# EAGLE design demeter_v26 (EAGLE 6.2)
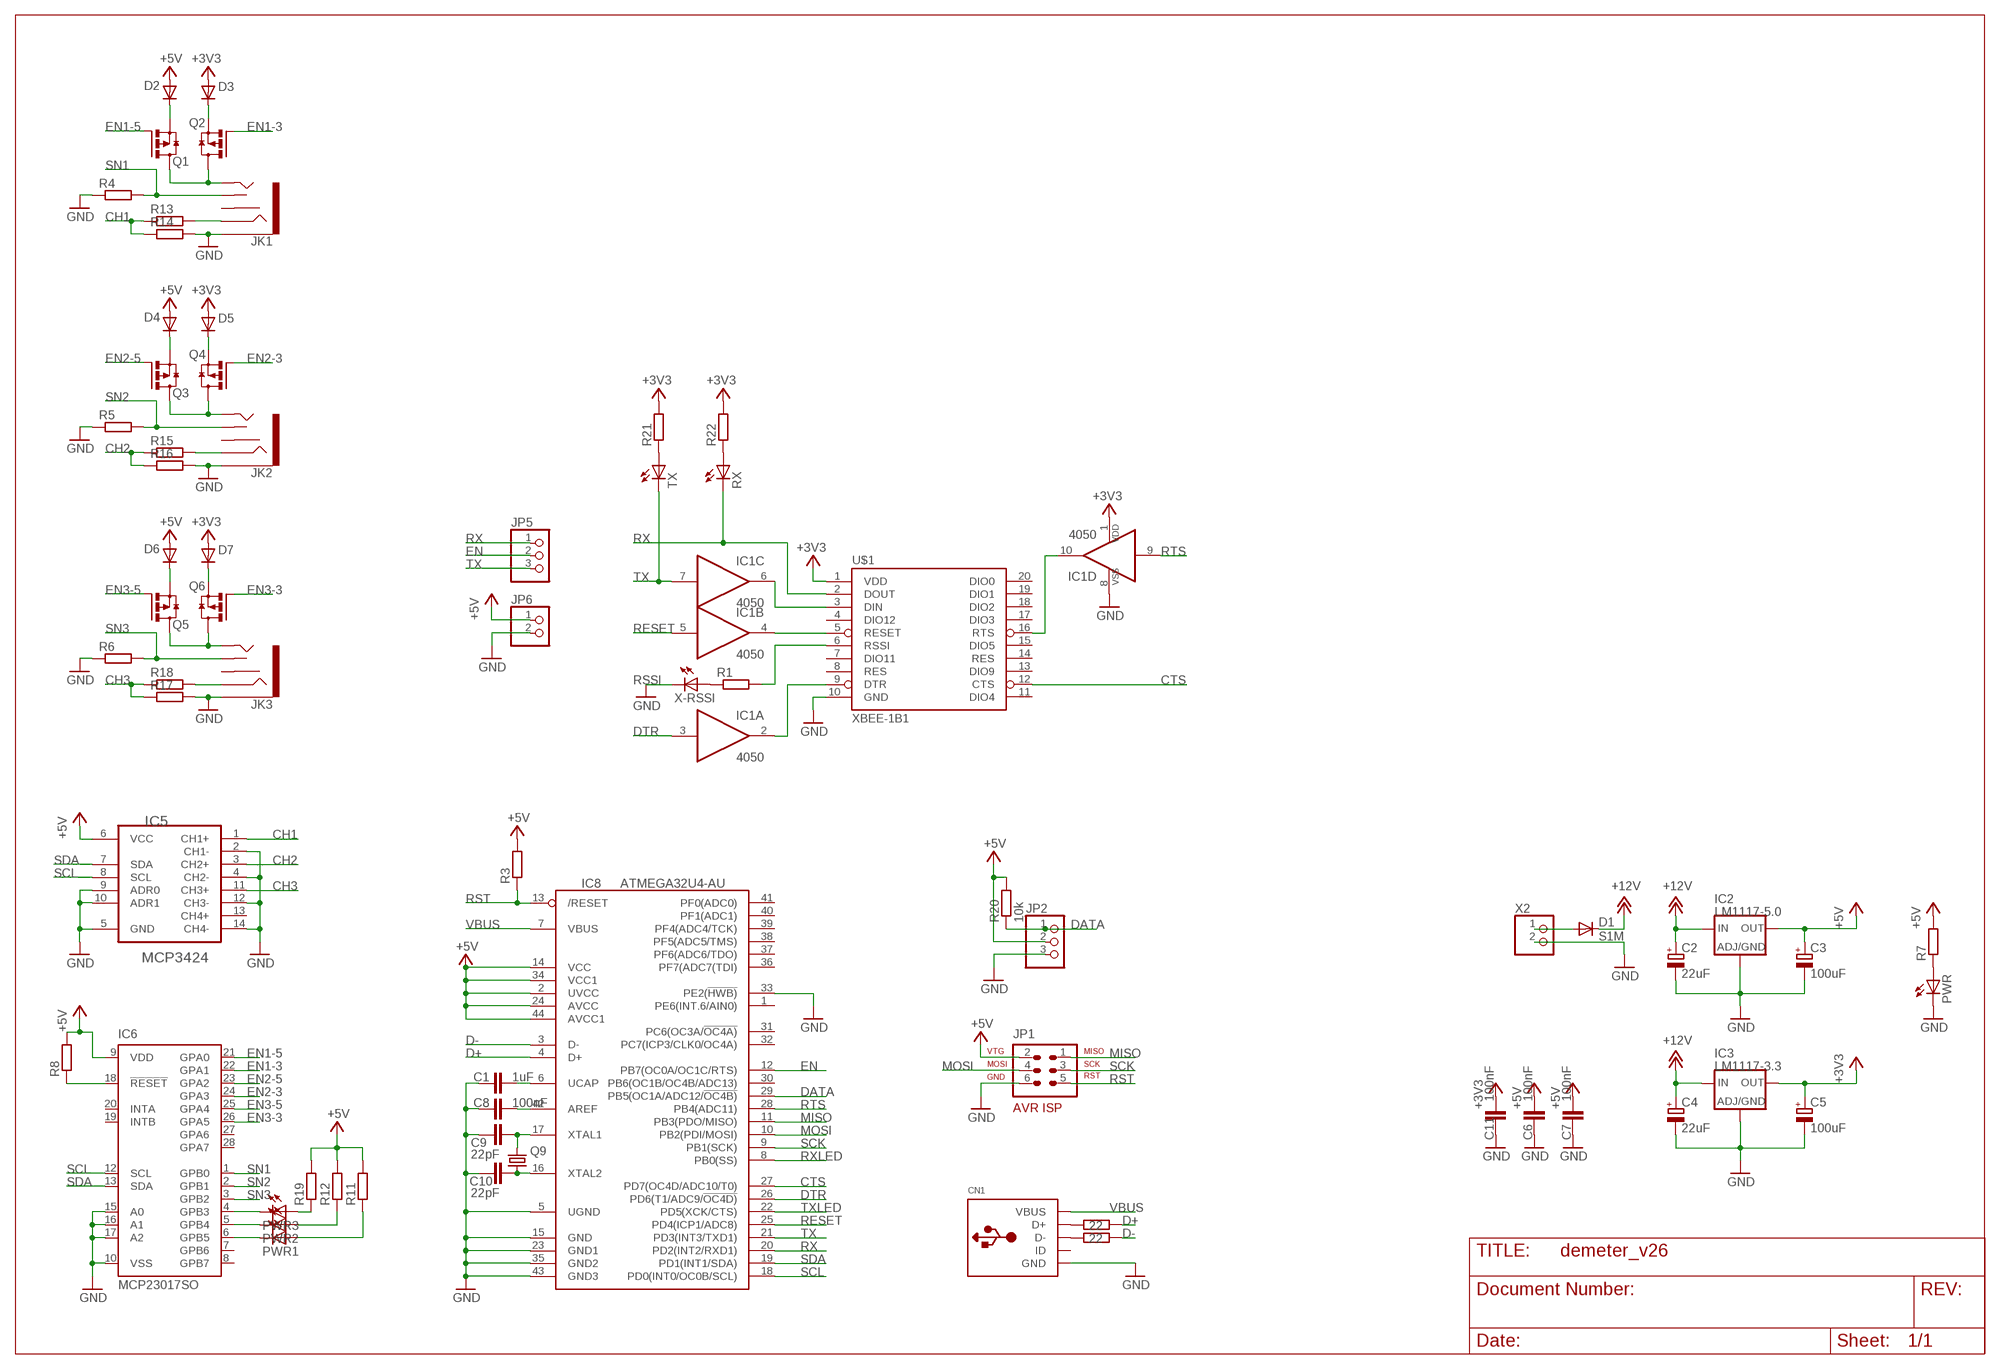
[diagram p0: schematic, sheet 1]

## Parts
C1  1uF  C-EUC0805K  [C0805K]
C2  22uF  CPOL-EUPD  [PANASONIC_D]
C3  100uF  CPOL-EUPD  [PANASONIC_D]
C4  22uF  CPOL-EUPD  [PANASONIC_D]
C5  100uF  CPOL-EUPD  [PANASONIC_D]
C6  100nF  C-EUC0805K  [C0805K]
C7  100nF  C-EUC0805K  [C0805K]
C8  100nF  C-EUC0805K  [C0805K]
C9  22pF  C-EUC0805K  [C0805K]
C10  22pF  C-EUC0805K  [C0805K]
C11  100nF  C-EUC0805K  [C0805K]
CN1  USBMINIB  [USB-MINIB]
D1  S1M  [DO-214AC]
D2  MBR0520  [SOD123]
D3  MBR0520  [SOD123]
D4  MBR0520  [SOD123]
D5  MBR0520  [SOD123]
D6  MBR0520  [SOD123]
D7  MBR0520  [SOD123]
IC1  4050  4050D  [SO16]
IC2  LM1117-5.0  LM1117DT  [DPACK]
IC3  LM1117-3.3  LM1117DT  [DPACK]
IC5  MCP3424  [SO14]
IC6  MCP23017SO  [SO28W]
IC8  ATMEGA32U4-AU  [TQFP44]
JK1  AUDIO-JACK2PTH  [AUDIO-JACK]
JK2  AUDIO-JACK2PTH  [AUDIO-JACK]
JK3  AUDIO-JACK2PTH  [AUDIO-JACK]
JP1  AVR-ISP-6  [AVR-ISP-6]
JP2  PINHD-1X3180  [1X03]
JP5  PINHD-1X3180  [1X03]
JP6  PINHD-1X2  [1X02]
PWR  LED0805  [CHIP-LED0805]
PWR1  LED0805  [CHIP-LED0805]
PWR2  LED0805  [CHIP-LED0805]
PWR3  LED0805  [CHIP-LED0805]
Q1  IRLML6402  [SOT23]
Q2  IRLML6402  [SOT23]
Q3  IRLML6402  [SOT23]
Q4  IRLML6402  [SOT23]
Q5  IRLML6402  [SOT23]
Q6  IRLML6402  [SOT23]
Q9  CRYSTALHC49UP  [HC49UP]
R1  R-EU_R0805  [R0805]
R3  R-EU_R0805  [R0805]
R4  R-EU_R0805  [R0805]
R5  R-EU_R0805  [R0805]
R6  R-EU_R0805  [R0805]
R7  R-EU_R0805  [R0805]
R8  R-EU_R0805  [R0805]
R9  22  R-EU_R0805  [R0805]
R10  22  R-EU_R0805  [R0805]
R11  R-EU_R0805  [R0805]
R12  R-EU_R0805  [R0805]
R13  R-EU_R0805  [R0805]
R14  R-EU_R0805  [R0805]
R15  R-EU_R0805  [R0805]
R16  R-EU_R0805  [R0805]
R17  R-EU_R0805  [R0805]
R18  R-EU_R0805  [R0805]
R19  R-EU_R0805  [R0805]
R20  10k  R-EU_R0805  [R0805]
R21  R-EU_R0805  [R0805]
R22  R-EU_R0805  [R0805]
RX  LED0805  [CHIP-LED0805]
TX  LED0805  [CHIP-LED0805]
U$1  XBEE-1B1  [XBEE-1]
X2  W237-102  [W237-102]
X-RSSI  LED0805  [CHIP-LED0805]

## Nets
+3V3: C5.+ C11.1 D3.A D5.A D7.A IC1.1(P:VDD) IC3.4(OUT) R21.2 R22.2 U$1.1(VDD)
+5V: C3.+ C6.1 C7.1 D2.A D4.A D6.A IC2.4(OUT) IC5.6(VCC) IC6.9(VDD) IC8.2(UVCC) IC8.14(VCC) IC8.24(AVCC) IC8.34(VCC1) IC8.44(AVCC1) JP1.2(VTG) JP2.2 JP6.1 R3.2 R7.2 R8.2 R11.2 R12.2 R19.2 R20.2
+12V: C2.+ C4.+ D1.C IC2.3(IN) IC3.3(IN)
CH1: IC5.1(CH1+) R13.1 R14.1
CH2: IC5.3(CH2+) R15.1 R16.1
CH3: IC5.11(CH3+) R17.1 R18.1
CTS: IC8.27(PD7(OC4D/ADC10/T0)) U$1.12(CTS)
D+: IC8.4(D+) R9.1
D-: IC8.3(D-) R10.1
DATA: IC8.29(PB5(OC1A/ADC12/!OC4B)) JP2.1 R20.1
DTR: IC1.3(A:I) IC8.26(PD6(T1/ADC9/!OC4D))
EN: IC8.12(PB7(OC0A/OC1C/RTS)) JP5.2
EN1-3: IC6.22(GPA1) Q2.1(G)
EN1-5: IC6.21(GPA0) Q1.1(G)
EN2-3: IC6.24(GPA3) Q4.1(G)
EN2-5: IC6.23(GPA2) Q3.1(G)
EN3-3: IC6.26(GPA5) Q6.1(G)
EN3-5: IC6.25(GPA4) Q5.1(G)
GND: C1.2 C2.- C3.- C4.- C5.- C6.2 C7.2 C8.2 C9.2 C10.2 C11.2 CN1.GND IC1.8(P:VSS) IC2.1(ADJ) IC3.1(ADJ) IC5.2(CH1-) IC5.4(CH2-) IC5.5(GND) IC5.9(ADR0) IC5.10(ADR1) IC5.12(CH3-) IC5.14(CH4-) IC6.10(VSS) IC6.15(A0) IC6.16(A1) IC6.17(A2) IC8.5(UGND) IC8.15(GND) IC8.23(GND1) IC8.33(PE2(!HWB)) IC8.35(GND2) IC8.43(GND3) JK1.SLEEVE JK2.SLEEVE JK3.SLEEVE JP1.6(GND) JP2.3 JP6.2 PWR.C R4.1 R5.1 R6.1 R14.2 R16.2 R17.2 U$1.10(GND) X2.2 X-RSSI.C
MISO: IC8.11(PB3(PDO/MISO)) JP1.1(MISO)
MOSI: IC8.10(PB2(PDI/MOSI)) JP1.4(MOSI)
N$1: D1.A X2.1
N$2: PWR.A R7.1
N$3: IC1.6(C:O) U$1.3(DIN)
N$4: IC1.4(B:O) U$1.5(RESET)
N$5: PWR1.A R11.1
N$6: R1.1 X-RSSI.A
N$7: IC1.2(A:O) U$1.9(DTR)
N$8: IC1.10(D:O) U$1.16(RTS)
N$9: IC6.6(GPB5) PWR1.C
N$10: IC6.4(GPB3) PWR3.C
N$11: IC6.18(!RESET) R8.1
N$12: JK1.TIP Q1.3(D) Q2.3(D)
N$13: D2.C Q1.2(S)
N$14: D3.C Q2.2(S)
N$15: JK2.TIP Q3.3(D) Q4.3(D)
N$16: D4.C Q3.2(S)
N$17: D5.C Q4.2(S)
N$18: JK3.TIP Q5.3(D) Q6.3(D)
N$19: D6.C Q5.2(S)
N$20: D7.C Q6.2(S)
N$22: PWR2.A R12.1
N$23: PWR3.A R19.1
N$24: C1.1 IC8.6(UCAP)
N$25: C8.1 IC8.42(AREF)
N$26: C9.1 IC8.17(XTAL1) Q9.2
N$27: C10.1 IC8.16(XTAL2) Q9.1
N$28: CN1.D+ R9.2
N$29: CN1.D- R10.2
N$30: JK1.RING R13.2
N$32: JK2.RING R15.2
N$33: IC6.5(GPB4) PWR2.C
N$34: JK3.RING R18.2
N$36: R21.1 TX.A
N$37: R22.1 RX.A
RESET: IC1.5(B:I) IC8.25(PD4(ICP1/ADC8))
RSSI: R1.2 U$1.6(RSSI)
RST: IC8.13(/RESET) JP1.5(RST) R3.1
RTS: IC1.9(D:I) IC8.28(PB4(ADC11))
RX: IC8.20(PD2(INT2/RXD1)) JP5.1 RX.C U$1.2(DOUT)
RXLED: IC8.8(PB0(SS))
SCK: IC8.9(PB1(SCK)) JP1.3(SCK)
SCL: IC5.8(SCL) IC6.12(SCL) IC8.18(PD0(INT0/OC0B/SCL))
SDA: IC5.7(SDA) IC6.13(SDA) IC8.19(PD1(INT1/SDA))
SN1: IC6.1(GPB0) JK1.TSH R4.2
SN2: IC6.2(GPB1) JK2.TSH R5.2
SN3: IC6.3(GPB2) JK3.TSH R6.2
TX: IC1.7(C:I) IC8.21(PD3(INT3/TXD1)) JP5.3 TX.C
TXLED: IC8.22(PD5(XCK/CTS))
VBUS: CN1.VBUS IC8.7(VBUS)
Unconnected: CN1.ID IC1.11(E:I) IC1.12(E:O) IC1.14(F:I) IC1.15(F:O) IC5.13(CH4+) IC6.7(GPB6) IC6.8(GPB7) IC6.19(INTB) IC6.20(INTA) IC6.27(GPA6) IC6.28(GPA7) IC8.1(PE6(INT.6/AIN0)) IC8.30(PB6(OC1B/OC4B/ADC13)) IC8.31(PC6(OC3A/!OC4A)) IC8.32(PC7(ICP3/CLK0/OC4A)) IC8.36(PF7(ADC7(TDI)) IC8.37(PF6(ADC6/TDO)) IC8.38(PF5(ADC5/TMS)) IC8.39(PF4(ADC4/TCK)) IC8.40(PF1(ADC1)) IC8.41(PF0(ADC0)) JK1.RSH JK2.RSH JK3.RSH U$1.4(DIO12) U$1.7(DIO11) U$1.8(RES) U$1.11(DIO4) U$1.13(DIO9) U$1.14(RES) U$1.15(DIO5) U$1.17(DIO3) U$1.18(DIO2) U$1.19(DIO1) U$1.20(DIO0)

## Library data of the parts
C1 C6-C11 = mark_2:C-EU: CAPACITOR, European symbol
C2-C5 = mark_2:CPOL-EU: POLARIZED CAPACITOR, European symbol
CN1 = mark_2:USB: USB Connectors USBMINIB - Surface Mount Female Mini-B USB Connector 4UConnector: 06564 By microbuilder.eu Thru-hole RA Female Mini-B USB Connector 4UConnector: 18732 By ladyada.net
D1 = mark_2:S1M
D2-D7 = mark_2:MBR0520: SCHOTTKY BARRIER RECTIFIER Source: http://onsemi.com .. MBR0520LT1-D.pdf
IC1 = mark_2:4050: Hex non-inverting BUFFER
IC2 IC3 = mark_2:LM1117: Low drop fixed and adjustable positive voltage regulators 1 A Source: http://www.st.com/stonline/products/literature/ds/7194/ld1117axx.pdf
IC5 = mark_2:MCP3424: Analog-to-Digital Converter; MPN: MCP3424-E/SL; OC_FARNELL: 1630424; OC_NEWARK: 54M4871; PACKAGE: SOIC-14; SUPPLIER: Microchip
IC6 = mark_2:MCP23017: http://ww1.microchip.com/downloads/en/DeviceDoc/21952a.pdf Source: http://ww1.microchip.com/downloads/en/DeviceDoc/21952a.pdf; MF: MICROCHIP; MPN: MCP23017-E/SO; OC_FARNELL: 1332087; OC_NEWARK: 31K2958
IC8 = mark_2:ATMEGA32U4: http://www.ladyada.net/library/eagle
JK1-JK3 = mark_2:AUDIO-JACK2
JP1 = mark_2:AVR-ISP-6: AVR ISP-6 Serial Programming Header
JP2 JP5 = mark_2:PINHD-1X3: PIN HEADER
JP6 = mark_2:PINHD-1X2: PIN HEADER
PWR PWR1-PWR3 RX TX X-RSSI = mark_2:LED
Q1-Q6 = mark_2:IRLML6402: Single P-Channe MOSFET
Q9 = mark_2:CRYSTAL: CRYSTAL
R1 R3-R22 = mark_2:R-EU_: RESISTOR, European symbol
U$1 = mark_2:XBEE-1
X2 = mark_2:W237-102: WAGO SCREW CLAMP

## Board
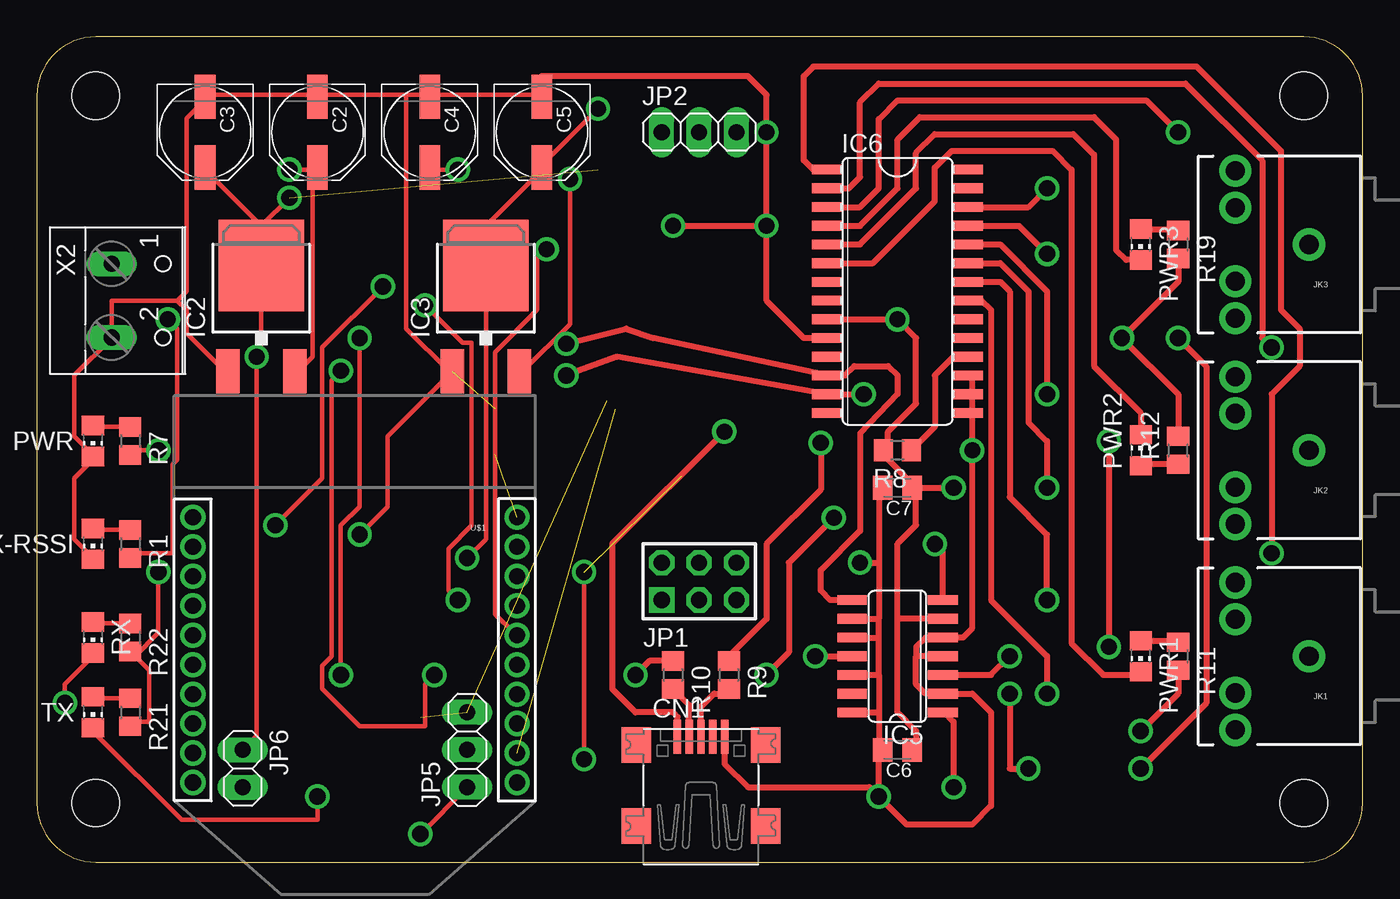
[diagram p1: board, top side]
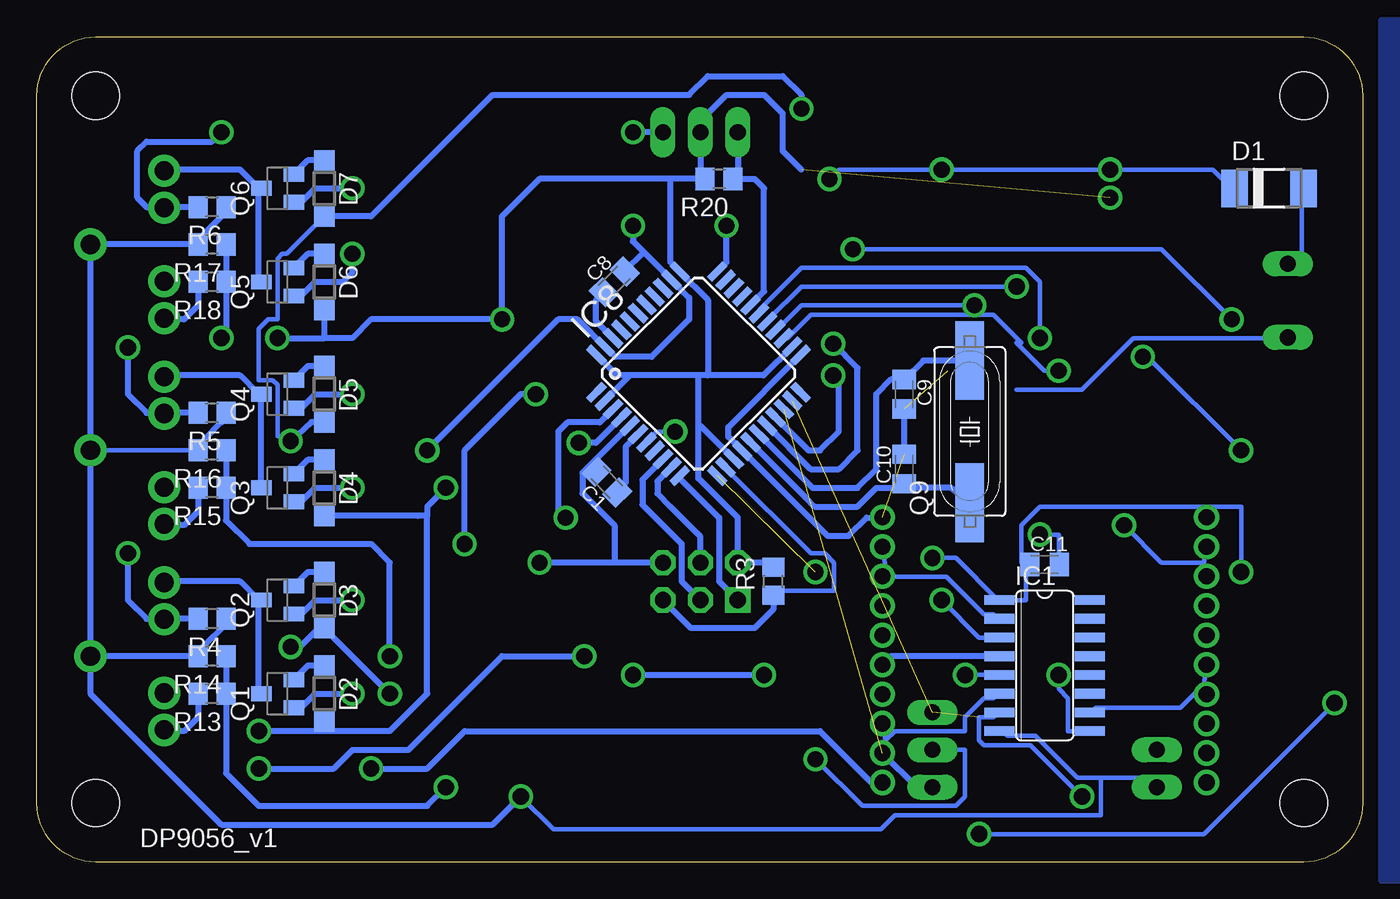
[diagram p2: board, bottom side, seen from below]

Size 90 x 56 mm. Coordinates in mm from the lower left corner, seen from the top.
Copper layers (1*16): Top 0.035mm / dielectric 1.5mm / Bottom 0.035mm
Design rules: minimum track width 12mil, minimum drill 1.1mm, track to track 8mil, track to pad 8mil, pad to pad 8mil, via to via 8mil, smd to smd 8mil, copper to edge 10mil, drill to drill 8mil, minimum pad ring 12mil, minimum via ring 10mil, stop-mask expansion 4mil, vias tented up to drill 25mil, thermal gap 10mil

### Footprints (pad centres in the part's own frame; a part is rotated, then mirrored left to right if it is on the bottom)
C0805K = smd 1.3 x 1.6: 1 -1,0; 2 1,0
PANASONIC_D = smd 3 x 1.4: + 2.4,0; - -2.4,0
USB-MINIB = smd 0.5 x 2.308: D+ 0,4.064; D- -0.8,4.064; GND 1.6,4.064; ID 0.8,4.064; VBUS -1.6,4.064 | smd 2 x 2.4: GND1 -4.4,-2; GND2 -4.4,3.5; GND3 4.4,3.5; GND4 4.4,-2
DO-214AC = smd 1.778 x 2.54: A 2.342,0; C -2.342,0
SOD123 = smd 1.4 x 1.4: A 1.9,0; C -1.9,0
SO16 = smd 0.66 x 2.032: 1 -4.445,-3.073; 2 -3.175,-3.073; 3 -1.905,-3.073; 4 -0.635,-3.073; 5 0.635,-3.073; 6 1.905,-3.073; 7 3.175,-3.073; 8 4.445,-3.073; 9 4.445,3.073; 10 3.175,3.073; 11 1.905,3.073; 12 0.635,3.073; 13 -0.635,3.073; 14 -1.905,3.073; 15 -3.175,3.073; 16 -4.445,3.073
DPACK = smd 1.6 x 3: 1 -2.28,-4.8; 3 2.28,-4.8 | smd 5.8 x 6.2: 4 0,2.38
SO14 = smd 2.032 x 0.66: 1 -3.073,3.81; 2 -3.073,2.54; 3 -3.073,1.27; 4 -3.073,0; 5 -3.073,-1.27; 6 -3.073,-2.54; 7 -3.073,-3.81; 8 3.073,-3.81; 9 3.073,-2.54; 10 3.073,-1.27; 11 3.073,0; 12 3.073,1.27; 13 3.073,2.54; 14 3.073,3.81
SO28W = smd 0.66 x 2.032: 1 -7.62,-4.78; 2 -6.35,-4.78; 3 -5.08,-4.78; 4 -3.81,-4.78; 5 -2.54,-4.78; 6 -1.27,-4.78; 7 0,-4.78; 8 1.27,-4.78; 9 2.54,-4.78; 10 3.81,-4.78; 11 5.08,-4.78; 12 6.35,-4.78; 13 7.62,-4.78; 14 8.89,-4.78; 15 8.89,4.78; 16 7.62,4.78; 17 6.35,4.78; 18 5.08,4.78; 19 3.81,4.78; 20 2.54,4.78; 21 1.27,4.78; 22 0,4.78; 23 -1.27,4.78; 24 -2.54,4.78; 25 -3.81,4.78; 26 -5.08,4.78; 27 -6.35,4.78; 28 -7.62,4.78
TQFP44 = smd 1.5 x 0.5: 1 -5.8,4; 2 -5.8,3.2; 3 -5.8,2.4; 4 -5.8,1.6; 5 -5.8,0.8; 6 -5.8,0; 7 -5.8,-0.8; 8 -5.8,-1.6; 9 -5.8,-2.4; 10 -5.8,-3.2; 11 -5.8,-4; 23 5.8,-4; 24 5.8,-3.2; 25 5.8,-2.4; 26 5.8,-1.6; 27 5.8,-0.8; 28 5.8,0; 29 5.8,0.8; 30 5.8,1.6; 31 5.8,2.4; 32 5.8,3.2; 33 5.8,4 | smd 0.5 x 1.5: 12 -4,-5.8; 13 -3.2,-5.8; 14 -2.4,-5.8; 15 -1.6,-5.8; 16 -0.8,-5.8; 17 0,-5.8; 18 0.8,-5.8; 19 1.6,-5.8; 20 2.4,-5.8; 21 3.2,-5.8; 22 4,-5.8; 34 4,5.8; 35 3.2,5.8; 36 2.4,5.8; 37 1.6,5.8; 38 0.8,5.8; 39 0,5.8; 40 -0.8,5.8; 41 -1.6,5.8; 42 -2.4,5.8; 43 -3.2,5.8; 44 -4,5.8
AUDIO-JACK = drill 1.3 pad 2.184: RING 5,5; RSH 5,2.5; SLEEVE 0,0; TIP 5,-5; TSH 5,-2.5
AVR-ISP-6 = drill 1.1 square: 1 -2.54,-1.27 | drill 1.1 octagon: 2 -2.54,1.27; 3 0,-1.27; 4 0,1.27; 5 2.54,-1.27; 6 2.54,1.27
1X03 = drill 1.1 long: 1 -2.54,0; 2 0,0; 3 2.54,0
1X02 = drill 1.1 long: 1 -1.27,0; 2 1.27,0
CHIP-LED0805 = smd 1.5 x 1.3: A 0,-1.05; C 0,1.05
SOT23 = smd 1 x 1.4: 1 -0.95,-1.1; 2 0.95,-1.1; 3 0,1.1
HC49UP = smd 5.334 x 1.93: 1 -4.826,0; 2 4.826,0
R0805 = smd 1.3 x 1.5: 1 -0.95,0; 2 0.95,0
XBEE-1 = drill 1.1: 1 -11,20; 2 -11,18; 3 -11,16; 4 -11,14; 5 -11,12; 6 -11,10; 7 -11,8; 8 -11,6; 9 -11,4; 10 -11,2; 11 11,2; 12 11,4; 13 11,6; 14 11,8; 15 11,10; 16 11,12; 17 11,14; 18 11,16; 19 11,18; 20 11,20
DP9056_V1 = hole 3.2: 4,4; 86,4; 86,52; 4,52
W237-102 = drill 1.1 long: 1 -2.5,-1.27; 2 2.5,-1.27

### Placement (x,y rotation side)
C1  51.31,25.78 135 bottom
C2  19.05,49.53 270 top
C3  11.43,49.53 270 top
C4  26.67,49.53 270 top
C5  34.29,49.53 270 top
C6  58.42,7.62 180 top
C7  58.42,25.4 180 top
C8  50.8,39.37 45 bottom
C9  31.11,31.75 270 bottom
C10  31.11,26.67 90 bottom
C11  21.59,20.19 0 bottom
CN1  45.08,4.45 0 top
D1  6.35,45.72 0 bottom
D2  70.48,11.43 270 bottom
D3  70.48,17.78 270 bottom
D4  70.48,25.4 270 bottom
D5  70.48,31.75 270 bottom
D6  70.48,39.37 270 bottom
D7  70.48,45.72 270 bottom
IC1  21.59,13.34 270 bottom
IC2  15.24,38.1 0 top
IC3  30.48,38.1 0 top
IC5  58.42,13.97 180 top
IC6  58.42,39.37 270 top
IC8  45.08,33.15 45 bottom
JK1  86.36,13.97 180 top
JK2  86.36,27.94 180 top
JK3  86.36,41.91 180 top
JP1  44.96,19.05 0 top
JP2  44.96,49.53 0 top
JP5  29.21,7.62 90 top
JP6  13.97,6.35 270 top
PWR  3.81,28.57 180 top
PWR1  74.93,13.97 180 top
PWR2  74.93,27.94 0 top
PWR3  74.93,41.91 180 top
Q1  73.66,11.43 90 bottom
Q2  73.66,17.78 90 bottom
Q3  73.66,25.4 90 bottom
Q4  73.66,31.75 90 bottom
Q5  73.66,39.37 90 bottom
Q6  73.66,45.72 90 bottom
Q9  26.67,29.21 90 bottom
R1  6.35,21.59 270 top
R3  40,19.05 90 bottom
R4  78.11,16.51 180 bottom
R5  78.11,30.48 180 bottom
R6  78.11,44.45 180 bottom
R7  6.35,28.57 270 top
R8  58.42,27.94 180 top
R9  46.99,12.7 270 top
R10  43.18,12.7 270 top
R11  77.47,13.97 270 top
R12  77.47,27.94 90 top
R13  78.11,11.43 180 bottom
R14  78.11,13.97 180 bottom
R15  78.11,25.4 180 bottom
R16  78.11,27.94 180 bottom
R17  78.11,41.91 180 bottom
R18  78.11,39.37 180 bottom
R19  77.47,41.91 270 top
R20  43.69,46.35 180 bottom
R21  6.35,10.16 270 top
R22  6.35,15.24 270 top
RX  3.81,15.24 180 top
TX  3.81,10.16 180 top
U$1  21.59,25.4 180 top
U$6  [DP9056_V1]  0,0 0 top
X2  6.35,38.1 270 top
X-RSSI  3.81,21.59 180 top

### Tracks (layer width: path | path; a pad name or v marks a point on that pad's centre or on a via)
+3V3  (via drill 1.1)
  Top 0.305: 6.67,13.97 R22.2 6.67,13.97 | 6.67,13.97 7.62,13.02 7.62,9.53 6.35,9.53 R21.2 | 6.67,13.97 8.26,15.56 v8.26,19.68 | v38.1,51.12 34.29,47.31 C5.+ 34.29,46.99 30.48,43.18 IC3.4 30.48,21.91 v29.21,20.64
  Top 0.406: v72.77,28.57 v72.77,14.61 | v66.04,11.43 66.04,6.35 v67.31,6.35
  Bottom 0.305: D7.A 73.03,41.27 73.34,41.27 73.66,40.96 73.66,36.83 74.3,36.83 74.93,36.2 74.93,32.7 73.98,32.7 73.66,32.38 73.66,28.89 72.71,28.89 v72.77,28.57 | v8.26,19.68 8.26,24.13 21.91,24.13 23.18,22.86 23.18,20.32 22.86,20.32 C11.1 22.86,20 22.86,17.78 IC1.1 24.77,17.78 27.62,20.64 v29.21,20.64
  Bottom 0.406: D7.A 67.31,43.81 59.05,52.07 45.72,52.07 44.45,53.34 39.37,53.34 38.1,52.07 v38.1,51.12 | D5.A 71.37,29.85 v72.77,28.57 | v72.77,14.61 72.14,14.61 70.86,15.88 D3.A v66.04,11.44 v66.04,11.43 | v67.31,6.35 63.5,6.35 60.96,8.89 36.83,8.89 33.34,5.4 U$1.1
+5V  (via drill 1.1)  (1 unrouted)
  Top 0.305: 59.37,25.72 59.37,25.4 C7.1 | 57.78,27.94 R8.2 | 59.37,7.62 C6.1 | v8.26,27.94 6.35,27.94 R7.2 | 15.24,43.18 11.43,46.99 C3.+ | JP6.1 14.92,8.57 v14.92,34.29 15.24,34.61 IC2.4 15.24,43.18 | 15.24,43.18 v17.14,45.08
  Top 0.406: C6.1 59.69,7.89 59.69,8.89 58.42,10.16 58.42,16.51 | IC5.6 58.42,16.51 | 58.42,16.51 58.42,21.59 59.69,22.86 59.69,25.13 C7.1 59.37,25.35 59.64,25.35 59.69,25.4 v62.23,25.4 | 59.37,25.72 57.66,27.43 57.66,27.75 R8.2 57.78,28.25 57.78,29.21 59.69,31.11 59.69,35.56 v58.42,36.83 IC6.9 | R11.2 77.47,11.43 v74.93,8.89 | R12.2 77.47,31.75 v73.66,35.56 77.47,39.37 R19.2
  Bottom 0.305: v8.26,27.94 14.61,34.29 v14.92,34.29 | 44.45,46.35 R20.2 | R3.2
  Bottom 0.406: D6.A 70.48,35.56 | v73.66,35.56 70.48,35.56 | D4.A 64.14,23.5 63.5,23.5 | D2.A 70.48,8.89 | 70.48,8.89 v74.93,8.89 | 70.48,8.89 66.04,8.89 63.5,11.43 63.5,23.5 | 44.45,33.02 45.08,33.02 | 45.08,33.02 49.74,33.02 | 49.74,33.02 50.61,33.02 IC8.44 | IC8.2 49.74,33.02 | IC8.14 44.92,29.59 45.08,29.59 | 44.45,33.02 40.69,33.02 IC8.24 | 38.1,46.99 39.37,48.26 39.37,50.8 40.64,52.07 43.18,52.07 44.96,50.29 JP2.2 44.96,46.55 R20.2 44.83,46.35 44.96,46.48 45.08,46.35 46.99,46.35 | 44.45,33.02 44.45,38.17 IC8.34 46.99,40.71 46.99,46.35 | R3.2 40.32,20.32 JP1.2 42.42,23.37 45.08,26.04 45.08,29.59 | 46.99,46.35 55.88,46.35 58.42,43.81 v58.42,36.83 67.31,36.83 68.58,35.56 70.48,35.56 | v62.23,25.4 63.5,24.13 63.5,23.5 | 45.08,29.59 45.08,33.02
+12V  (via drill 1.1)
  Top 0.305: 18.73,46.99 19.05,46.99 C2.+ 18.73,46.99 | 18.73,46.99 v17.14,46.99 | 18.73,46.99 18.73,34.29 17.78,33.34 IC2.3 | v36.2,46.35 36.2,36.51 33.02,33.34 IC3.3 | v28.57,46.99 26.67,46.99 C4.+
  Bottom 0.305: D1.C 8.89,45.72 10.16,46.99 v17.14,46.99 v28.57,46.99 35.56,46.99 v36.2,46.35
CH1  (via drill 1.1)
  Top 0.305: 61.59,10.16 IC5.1
  Top 0.406: 61.59,10.16 62.23,9.53 v62.23,5.08
  Bottom 0.305: R14.1 | R13.1
  Bottom 0.406: R14.1 R13.1 | R13.1 77.15,6.03 74.93,3.81 63.5,3.81 v62.23,5.08
CH2  (via drill 1.1)
  Top 0.406: IC5.3 64.77,12.7 v66.04,13.97
  Bottom 0.305: R16.1 | R15.1
  Bottom 0.406: R16.1 R15.1 77.16,23.18 75.56,21.59 67.31,21.59 66.04,20.32 v66.04,13.97
CH3  (via drill 1.1)
  Top 0.406: v77.47,35.56 79.38,33.65 79.38,10.79 v74.93,6.35 | v52.83,13.97 IC5.11
  Bottom 0.406: R17.1 R18.1 77.16,35.88 v77.47,35.56 | v74.93,6.35 69.85,6.35 68.58,7.62 64.77,7.62 58.42,13.97 v52.83,13.97
CTS  (via drill 1.1)
  Top 0.305: v23.5,39.05 19.37,34.92 19.37,26.04 v16.19,22.86
  Bottom 0.305: v23.5,39.05 38.1,39.05 40.32,36.83 IC8.27 | v16.19,22.86 13.65,20.32 10.79,20.32 U$1.12
D+  (via drill 1.1)
  Top 0.305: R9.1
  Top 0.406: v53.21,28.45 53.21,25.27 49.53,21.59 49.53,16.51 46.99,13.97 R9.1
  Bottom 0.406: IC8.4 52.05,28.45 v53.21,28.45
D-  (via drill 1.1)
  Top 0.406: 43.18,13.97 R10.1 41.59,13.65 v40.64,12.7 | v54.1,23.37 51.05,20.32 51.05,14.22 v49.53,12.7
  Bottom 0.406: IC8.3 51.78,29.84 53.97,29.84 54.61,29.21 54.61,23.88 v54.1,23.37 | v49.53,12.7 v40.64,12.7
DATA
  Bottom 0.406: IC8.29 40.64,38.72 40.64,45.72 41.27,46.35 R20.1 42.42,46.8 JP2.1
DTR  (via drill 1.1)
  Top 0.305: v26.35,37.78 28.89,35.24 29.53,35.24 29.53,22.86 27.94,21.27 27.94,18.41 v28.57,17.78
  Bottom 0.305: v26.35,37.78 38.1,37.78 39.69,36.2 IC8.26 | v28.57,17.78 26.04,15.24 IC1.3
EN  (via drill 1.1)  (1 unrouted)
  Top 0.305: v37.15,6.99 v37.15,19.68
  Bottom 0.305: v37.15,6.99 33.97,3.81 27.62,3.81 26.99,4.45 26.99,7.62 JP5.2
EN1-3  (via drill 1.1)
  Top 0.406: v68.58,17.78 68.58,22.23 66.04,24.77 66.04,38.73 65.41,39.37 IC6.22
  Bottom 0.406: Q2.1 72.07,16.83 71.12,17.78 v68.58,17.78
EN1-5  (via drill 1.1)
  Top 0.406: IC6.21 64.14,38.1 64.77,37.46 64.77,17.78 68.58,13.97 v68.58,11.43
  Bottom 0.406: Q1.1 72.07,10.48 71.12,11.43 v68.58,11.43
EN2-3  (via drill 1.1)
  Top 0.406: v68.58,31.75 68.58,38.73 65.41,41.91 IC6.24
  Bottom 0.406: Q4.1 72.07,30.8 71.12,31.75 v68.58,31.75
EN2-5  (via drill 1.1)
  Top 0.406: IC6.23 65.41,40.64 67.31,38.73 67.31,29.84 68.58,28.57 v68.58,25.4
  Bottom 0.406: v68.58,25.4 71.12,25.4 72.07,24.45 Q3.1
EN3-3  (via drill 1.1)
  Top 0.406: IC6.26 67.31,44.45 v68.58,45.72
  Bottom 0.406: Q6.1 72.07,44.77 71.12,45.72 v68.58,45.72
EN3-5  (via drill 1.1)
  Top 0.305: IC6.25 62.55,43.18
  Top 0.406: 62.55,43.18 66.67,43.18 v68.58,41.27
  Bottom 0.406: Q5.1 72.07,38.42 71.12,39.37 69.22,39.37 68.58,40 v68.58,41.27
GND  (via drill 1.1)  (2 unrouted)
  Top 0.305: 63.18,33.02 IC6.17 | 61.28,15.24 IC5.5 | 61.28,13.97 IC5.4 61.59,13.97 | 63.18,30.48 IC6.15 | 57.15,7.62 C6.2 57.47,7.62 | 55.56,15.24 IC5.10 | 55.56,16.51 IC5.9 55.24,16.51 | 55.56,10.16 IC5.14 | X-RSSI.C 3.81,20.64 2.54,21.91 2.54,26.04 3.81,27.3 PWR.C 3.81,27.62 2.54,28.89 2.54,33.02 5.08,35.56 X2.2 5.08,38.1 9.53,38.1 | 9.53,38.1 10.16,37.46 10.16,35.88 12.7,33.34 IC2.1 | v21.91,22.23 23.81,24.13 23.81,28.89 27.94,33.02 IC3.1 27.94,33.34 25.08,36.2 25.08,52.07 | 19.05,52.07 11.43,52.07 C3.- 11.43,51.75 10.16,50.48 10.16,38.73 9.53,38.1 | 19.05,52.07 25.08,52.07 | 25.08,52.07 26.67,52.07 | 19.05,52.07 C2.- | 26.67,52.07 34.29,52.07 | 26.67,52.07 C4.- | 34.29,52.07 34.29,52.39 | 34.29,52.07 C5.-
  Top 0.406: 55.56,10.16 57.15,10.16 | 57.15,12.7 57.15,15.24 | 57.15,15.24 57.15,16.51 | C7.2 57.15,25.13 57.15,25.15 57.4,24.89 57.15,24.64 57.15,20.32 | IC5.12 57.15,12.7 | IC5.9 57.15,16.51 | IC5.10 57.15,15.24 | 59.69,13.97 59.69,12.07 60.32,11.43 IC5.2 63.5,11.43 64.77,10.16 64.77,3.81 63.5,2.54 59.05,2.54 v57.15,4.45 | IC5.4 59.69,13.97 | 63.5,30.18 v63.5,27.94 63.5,15.88 62.87,15.24 IC5.5 60.32,15.24 59.69,14.61 59.69,13.97 | 63.18,31.77 IC6.16 63.5,31.45 | v57.15,4.45 57.15,7.35 C6.2 57.15,7.89 57.15,10.16 | 57.15,12.7 57.15,10.16 | 57.15,20.32 57.15,16.51 | v57.15,4.45 56.51,5.08 48.26,5.08 46.68,6.65 CN1.GND | IC6.10 52.07,35.56 49.53,38.1 v49.53,43.18 | v43.18,43.18 v49.53,43.18 | v55.88,20.32 57.15,20.32 | v49.53,43.18 v49.53,49.53 49.53,52.07 48.26,53.34 34.29,53.34 C5.- | 63.5,30.18 IC6.15 | 63.5,30.18 63.5,31.45 | 63.5,31.45 63.5,32.72 IC6.17
  Bottom 0.305: JK2.SLEEVE R16.2 | 77.47,30.48 R5.1 | v57.15,4.45 54.93,2.22 32.7,2.22 31.75,3.18 17.78,3.18 17.78,5.71 | 17.78,5.71 14.61,5.71 JP6.2 | 17.78,5.71 19.37,5.71 22.23,8.57 24.13,8.57 24.45,8.89 IC1.8 | v21.91,22.23 20.64,22.23 20.64,20.32 C11.2 | 23.5,32.07 19.05,32.07 15.56,35.56 5.08,35.56 X2.2
  Bottom 0.406: JK1.SLEEVE JK2.SLEEVE JK3.SLEEVE R17.2 78.74,42.22 78.74,42.54 77.16,44.13 R6.1 | 77.47,30.48 77.47,29.84 78.61,28.7 78.61,28.38 R16.2 | JK1.SLEEVE R14.2 78.74,14.29 78.74,14.61 77.16,16.19 R4.1 | JK1.SLEEVE 86.36,11.43 77.47,2.54 59.05,2.54 v57.15,4.45 | IC8.33 43.18,40.71 v43.18,43.18 | 48.79,41.38 IC8.35 45.72,38.31 45.72,36.83 48.26,34.29 50.75,34.29 IC8.43 53.29,36.83 54.61,36.83 v63.5,27.94 | 48.79,41.38 49.53,42.12 v49.53,43.18 | C8.2 48.79,41.38 | JP1.6 50.8,20.32 | 50.8,20.32 v55.88,20.32 | C1.2 52.27,27.09 IC8.5 52.96,26.4 52.96,25.02 50.8,22.86 50.8,20.32 | IC8.23 43.05,29.52 43.05,28.85 IC8.15 36.33,22.13 34.89,22.13 33.65,23.37 32.62,23.37 U$1.10 | JP2.3 v49.53,49.53 | C10.2 C9.2
  pour Bottom (isolate 0.813): -1.27,57.15 -10.16,57.15 -10.16,-1.27 -1.27,-1.27
MISO
  Bottom 0.406: IC8.11 46.36,26.04 43.69,23.37 43.69,19.05 JP1.1
MOSI
  Bottom 0.406: JP1.4 44.96,22.1 45.15,22.29 46.99,24.13 47.88,25.02 47.88,25.83 IC8.10
N$1
  Bottom 0.305: D1.A 4.13,45.72 4.13,40.64 5.08,40.64 X2.1
N$2
  Top 0.305: PWR.A 3.81,29.53 R7.1
N$3
  Bottom 0.305: IC1.6 24.77,11.43 25.08,11.11 25.72,11.11 26.99,9.84 26.99,8.89 31.75,8.89 32.38,8.26 U$1.3
N$4
  Bottom 0.406: IC1.4 32.02,13.97 U$1.5
N$5
  Top 0.406: PWR1.A 77.37,15.02 R11.1
N$6
  Top 0.305: X-RSSI.A 3.81,22.54 R1.1
N$7
  Bottom 0.305: IC1.2 24.77,16.51 25.08,16.83 25.72,16.83 28.26,19.37 31.75,19.37 32.38,20 U$1.9
N$8
  Bottom 0.305: IC1.10 18.41,10.16 18.1,10.48 12.38,10.48 10.79,12.07 U$1.16
N$9
  Top 0.305: 56.83,40.64 56.8,40.67
  Top 0.406: PWR1.C 74.71,12.7 72.39,12.7 70.23,14.86 70.23,46.99 68.96,48.26 62.1,48.26 60.96,47.12 60.96,44.83 56.8,40.67 56.77,40.64 IC6.6
N$10
  Top 0.406: PWR3.C 73.95,40.86 73.28,41.53 73.28,49.02 71.76,50.55 59.94,50.55 58.42,49.02 58.42,45.72 55.88,43.18 IC6.4
N$11
  Top 0.305: IC6.18 62.55,34.29 | R8.1
  Top 0.406: 62.55,34.29 62.23,34.29 60.96,33.02 60.96,29.53 R8.1
N$12
  Bottom 0.305: 74.93,11.43 Q1.3 | 74.93,17.78 Q2.3
  Bottom 0.406: 74.93,11.43 74.93,17.61 Q2.3 | 74.93,17.78 76.2,19.05 81.28,19.05 JK1.TIP
N$13
  Bottom 0.305: 72.39,12.38 Q1.2
  Bottom 0.406: D2.C 71.61,13.33 Q1.2
N$14
  Bottom 0.406: D3.C 71.61,19.68 Q2.2
N$15
  Bottom 0.305: 74.3,31.75 Q4.3
  Bottom 0.406: Q3.3 Q4.3 74.93,31.75 76.2,33.02 81.28,33.02 JK2.TIP
N$16
  Bottom 0.406: D4.C 71.61,27.3 Q3.2
N$17
  Bottom 0.406: D5.C 71.61,33.65 Q4.2
N$18
  Bottom 0.305: 74.93,39.37 Q5.3 | 74.93,45.72 Q6.3
  Bottom 0.406: 74.93,39.37 74.93,45.55 Q6.3 | 74.93,45.72 76.2,46.99 81.28,46.99 JK3.TIP
N$19
  Bottom 0.305: 72.39,40.32 Q5.2
  Bottom 0.406: D6.C 71.61,41.27 Q5.2
N$20
  Bottom 0.406: D7.C 71.61,47.62 Q6.2
N$22
  Top 0.406: R12.1 75.03,26.99 PWR2.A
N$23
  Top 0.406: PWR3.A 77.37,42.96 R19.1
N$24
  Bottom 0.406: IC8.6 50.04,28.19 50.04,25.76 C1.1
N$25
  Bottom 0.406: IC8.42 52.07,36.74 52.07,38.1 C8.1
N$26
  Bottom 0.406: Q9.2 29.83,34.04 C9.1 32.02,32.75 33.02,31.75 33.02,26.67 34.29,25.4 37.34,25.4 IC8.17
N$27
  Bottom 0.406: IC8.16 37.83,24.77 37.83,24.75 37.21,24.13 34.29,24.13 33.02,25.4 31.39,25.4 C10.1 30.85,25.4 27.94,25.4 Q9.1 26.92,24.38
N$28
  Top 0.406: CN1.D+ 45.08,10.54 45.97,11.43 46.67,11.43 R9.2
N$29
  Top 0.406: CN1.D- 44.28,10.64 R10.2
N$30
  Bottom 0.406: R13.2 79.06,9.85 80.01,8.89 81.28,8.89 JK1.RING
N$32
  Bottom 0.406: R15.2 79.06,23.82 80.01,22.86 81.28,22.86 JK2.RING
N$33
  Top 0.406: PWR2.C 74.93,30.48 71.76,33.65 71.76,48.01 70.36,49.4 60.96,49.4 59.69,48.13 59.69,45.72 55.88,41.91 IC6.5
N$34
  Bottom 0.305: R18.2
  Bottom 0.406: R18.2 79.06,37.78 80.01,36.83 81.28,36.83 JK3.RING
N$36
  Top 0.305: TX.A 3.81,11.11 R21.1
N$37
  Top 0.305: RX.A 3.81,16.19 R22.1
RESET  (via drill 1.1)
  Top 0.305: v20.64,33.34 20,32.7 20,13.97 19.37,13.34 19.37,11.75 21.91,9.21 26.35,9.21 26.35,12.07 v26.99,12.7
  Bottom 0.305: v20.64,33.34 21.59,33.34 23.5,35.24 23.18,35.24 25.08,37.15 37.46,37.15 39.05,35.56 IC8.25 | IC1.5 v26.99,12.7
RSSI  (via drill 1.1)
  Top 0.305: v8.89,36.83 9.53,36.2 9.53,27.3 9.21,26.99 9.21,20.96 6.35,20.96 R1.2 | v34.61,41.59 33.97,40.96 33.97,37.46 31.11,34.61 31.11,16.83 32.38,15.56 U$1.6
  Bottom 0.305: v8.89,36.83 13.65,41.59 v34.61,41.59
RST
  Bottom 0.305: IC8.13 43.18,26.67 37.46,20.96 36.51,20.96 35.88,20.32 35.88,18.41 40,18.41 R3.1
  Bottom 0.406: JP1.5 45.59,15.88 41.27,15.88 40,17.14 R3.1
RTS  (via drill 1.1)
  Top 0.305: v21.91,35.56 21.91,24.13 20.64,22.86 v20.64,12.7
  Bottom 0.305: v21.91,35.56 21.91,39.37 22.86,40.32 38.1,40.32 40.96,37.46 IC8.28 | v20.64,12.7 20.64,11.75 20,11.11 20,8.89 IC1.9
RX  (via drill 1.1)  (1 unrouted)
  Top 0.305: v1.9,10.79 1.9,12.07 3.81,13.97 RX.C | JP5.1 v26.04,1.9
  Bottom 0.305: v1.9,10.79 10.79,1.9 v26.04,1.9
  Bottom 0.406: JP5.1 30.27,5.08 U$1.2
SCK
  Bottom 0.406: IC8.9 48.89,25.94 48.89,24.26 46.23,21.59 46.23,19.05 JP1.3
SCL  (via drill 1.1)
  Top 0.406: IC5.8 53.85,17.78 53.21,18.41 53.21,19.81 55.88,22.48 55.88,29.08 58.42,31.75 58.42,33.02 57.78,33.65 55.5,33.65 54.86,33.02 IC6.12 41.91,35.56 40,36.2 v35.94,35.18
  Bottom 0.406: v35.94,35.18 34.29,33.53 34.29,27.94 35.56,26.67 37.48,26.67 IC8.18
SDA  (via drill 1.1)
  Top 0.406: v56.13,31.75 IC6.13 39.37,34.29 v35.94,33.02 | IC5.7 61.49,21.06 v60.96,21.59
  Bottom 0.406: v56.13,31.75 57.15,31.75 60.96,27.94 v60.96,21.59 | IC8.19 37.61,27.94 36.83,27.94 35.56,29.21 35.56,32.64 v35.94,33.02
SN1  (via drill 1.1)
  Top 0.305: 53.66,46.99 IC6.1
  Top 0.406: v83.82,20.96 83.82,31.75 85.73,33.65 85.73,36.2 84.45,37.46 84.45,48.26 78.74,53.97 52.7,53.97 52.07,53.34 52.07,47.62 52.7,46.99 IC6.1
  Bottom 0.406: R4.2 81.32,16.51 JK1.TSH 81.4,16.51 82.55,16.51 83.82,17.78 v83.82,20.96
SN2  (via drill 1.1)
  Top 0.406: v83.82,34.92 83.19,35.56 83.19,47.62 77.98,52.83 57.15,52.83 55.88,51.56 55.88,46.48 55.12,45.72 IC6.2
  Bottom 0.406: R5.2 81.32,30.48 JK2.TSH 81.4,30.48 82.55,30.48 83.82,31.75 v83.82,34.92
SN3  (via drill 1.1)
  Top 0.406: v77.47,49.53 75.31,51.69 58.42,51.69 57.15,50.42 57.15,45.72 55.88,44.45 IC6.3
  Bottom 0.406: R6.2 81.32,44.45 JK3.TSH 81.4,44.45 82.55,44.45 83.19,45.08 83.19,48.26 82.55,48.89 78.11,48.89 v77.47,49.53
TX  (via drill 1.1)  (2 unrouted)
  Top 0.305: v19.05,4.45 19.05,2.86 9.84,2.86 3.81,8.89 TX.C
  Bottom 0.305: v19.05,4.45 22.54,7.94 25.72,7.94 26.04,8.26 26.04,9.84 25.08,9.84 24.77,10.16 IC1.7
VBUS  (via drill 1.1)
  Top 0.305: 43.5,8.57 CN1.VBUS
  Top 0.406: 43.5,8.57 43.5,9.84 43.18,10.16 40.64,10.16 39.05,11.75 39.05,21.59 v46.67,29.21
  Bottom 0.305: v46.67,29.21 47.94,29.21 48.58,28.57 IC8.7